# EAGLE design smarties_sorter (EAGLE 6.1)
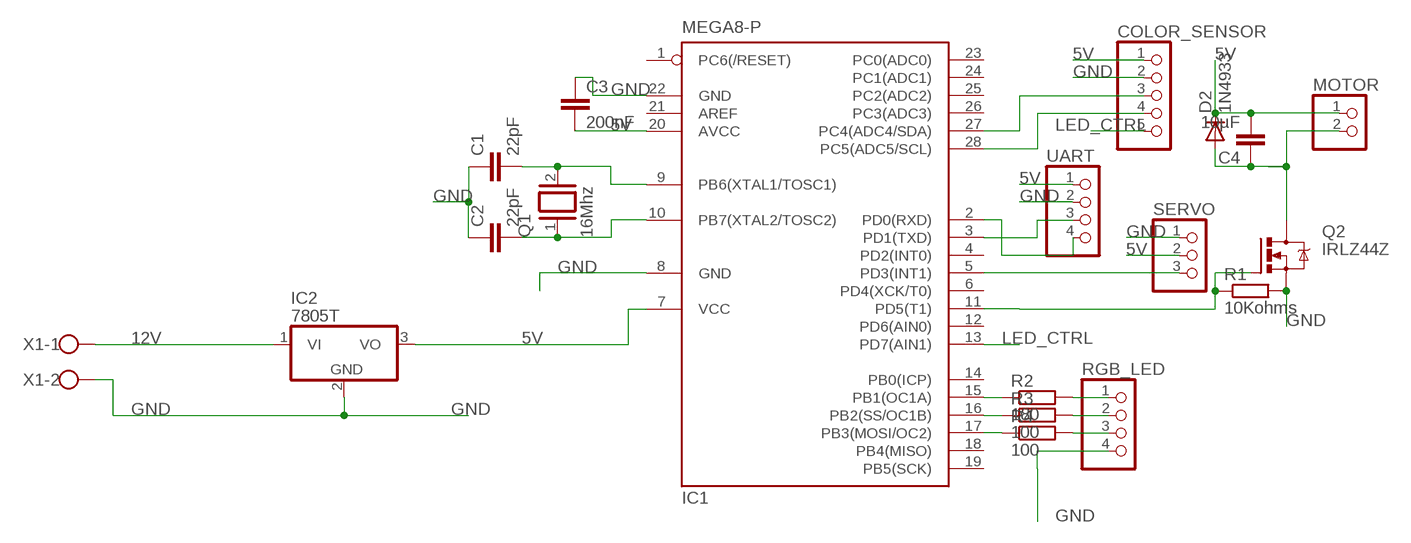
[diagram p0: schematic, sheet 1]

## Parts
C1  22pF  C5/5  [C5B5]
C2  22pF  C5/5  [C5B5]
C3  200nF  C5/3  [C5B3]
C4  10µF  C5/5  [C5B5]
COLOR_SENSOR  PINHD-1X5  [1X05]
D2  1N4933  [DO41-10]
IC1  MEGA8-P  [DIL28-3]
IC2  7805T  [TO220H]
MOTOR  PINHD-1X2  [1X02]
Q1  16Mhz  XTAL/S  [QS]
Q2  IRLZ44Z  [TO220BH]
R1  10Kohms  R-EU_0414/15  [0414/15]
R2  180  R-EU_0411/12  [0411/12]
R3  100  R-EU_0411/12  [0411/12]
R4  100  R-EU_0411/12  [0411/12]
RGB_LED  PINHD-1X4  [1X04]
SERVO  PINHD-1X3  [1X03]
UART  PINHD-1X4  [1X04]
X1  W237-102  [W237-102]

## Nets
5V: C3.2 C4.2 COLOR_SENSOR.1 D2.C IC1.7(VCC) IC1.20(AVCC) IC2.3(VO) MOTOR.1 SERVO.2 UART.1
12V: IC2.1(VI) X1.1
B_LED: IC1.17(PB3(MOSI/OC2)) R4.1
DRAIN: C4.1 D2.A MOTOR.2 Q2.D
G_LED: IC1.16(PB2(SS/OC1B)) R3.1
GND: C1.1 C2.1 C3.1 COLOR_SENSOR.2 IC1.8(GND) IC1.22(GND) IC2.2(GND) Q2.S R1.2 RGB_LED.4 SERVO.1 UART.2 X1.2
LED_CTRL: COLOR_SENSOR.5 IC1.13(PD7(AIN1))
MOTOR_CMD: IC1.11(PD5(T1)) Q2.G R1.1
N$1: C1.2 IC1.9(PB6(XTAL1/TOSC1)) Q1.2
N$2: C2.2 IC1.10(PB7(XTAL2/TOSC2)) Q1.1
N$5: R2.2 RGB_LED.1
N$10: R3.2 RGB_LED.2
N$12: R4.2 RGB_LED.3
R_LED: IC1.15(PB1(OC1A)) R2.1
RX: IC1.2(PD0(RXD)) UART.4
SCL: COLOR_SENSOR.4 IC1.28(PC5(ADC5/SCL))
SDA: COLOR_SENSOR.3 IC1.27(PC4(ADC4/SDA))
SERVO_CMD: IC1.5(PD3(INT1)) SERVO.3
TX: IC1.3(PD1(TXD)) UART.3
Unconnected: IC1.1(PC6(/RESET)) IC1.4(PD2(INT0)) IC1.6(PD4(XCK/T0)) IC1.12(PD6(AIN0)) IC1.14(PB0(ICP)) IC1.18(PB4(MISO)) IC1.19(PB5(SCK)) IC1.21(AREF) IC1.23(PC0(ADC0)) IC1.24(PC1(ADC1)) IC1.25(PC2(ADC2)) IC1.26(PC3(ADC3))

## Library data of the parts
C1-C4 = capacitor-wima:C: CAPACITOR naming: grid - package width
COLOR_SENSOR = pinhead:PINHD-1X5: PIN HEADER
D2 = diode:1N4933: DIODE fast recovery rectifier, 1A
IC1 = atmel:MEGA8-P: MICROCONTROLLER 8 Kbytes FLASH, 1 kbytes SRAM, 512 bytes EEPROM, USART, 4-channel 10 bit ADC, 2-channel 8 bit ADC Pin compatible with Atmega48, ATMega88, ATMega168 Source: avr.lbr; OC_FARNELL: unknown; OC_NEWARK: unknown
IC2 = linear:78*: Positive VOLTAGE REGULATOR Source: http://cache.national.com/ds/LM/LM78L05.pdf http://www.fairchildsemi.com/ds/LM/LM7805.pdf
MOTOR = pinhead:PINHD-1X2: PIN HEADER
Q1 = special:XTAL/S: CRYSTAL
Q2 = transistor-power:IRLZ44Z: N-Channel HEXFET® Power MOSFET Logic Level AUTOMOTIVE MOSFET Source: http://www.irf.com/product-info/datasheets/data/irlz44zpbf.pdf
R1 = rcl:R-EU_: RESISTOR, European symbol
R2-R4 = resistor:R-EU_: RESISTOR, European symbol
RGB_LED UART = pinhead:PINHD-1X4: PIN HEADER
SERVO = pinhead:PINHD-1X3: PIN HEADER
X1 = con-wago-500:W237-102: WAGO SCREW CLAMP; MPN: 237-102; OC_FARNELL: unknown; OC_NEWARK: 70K9898

## Board
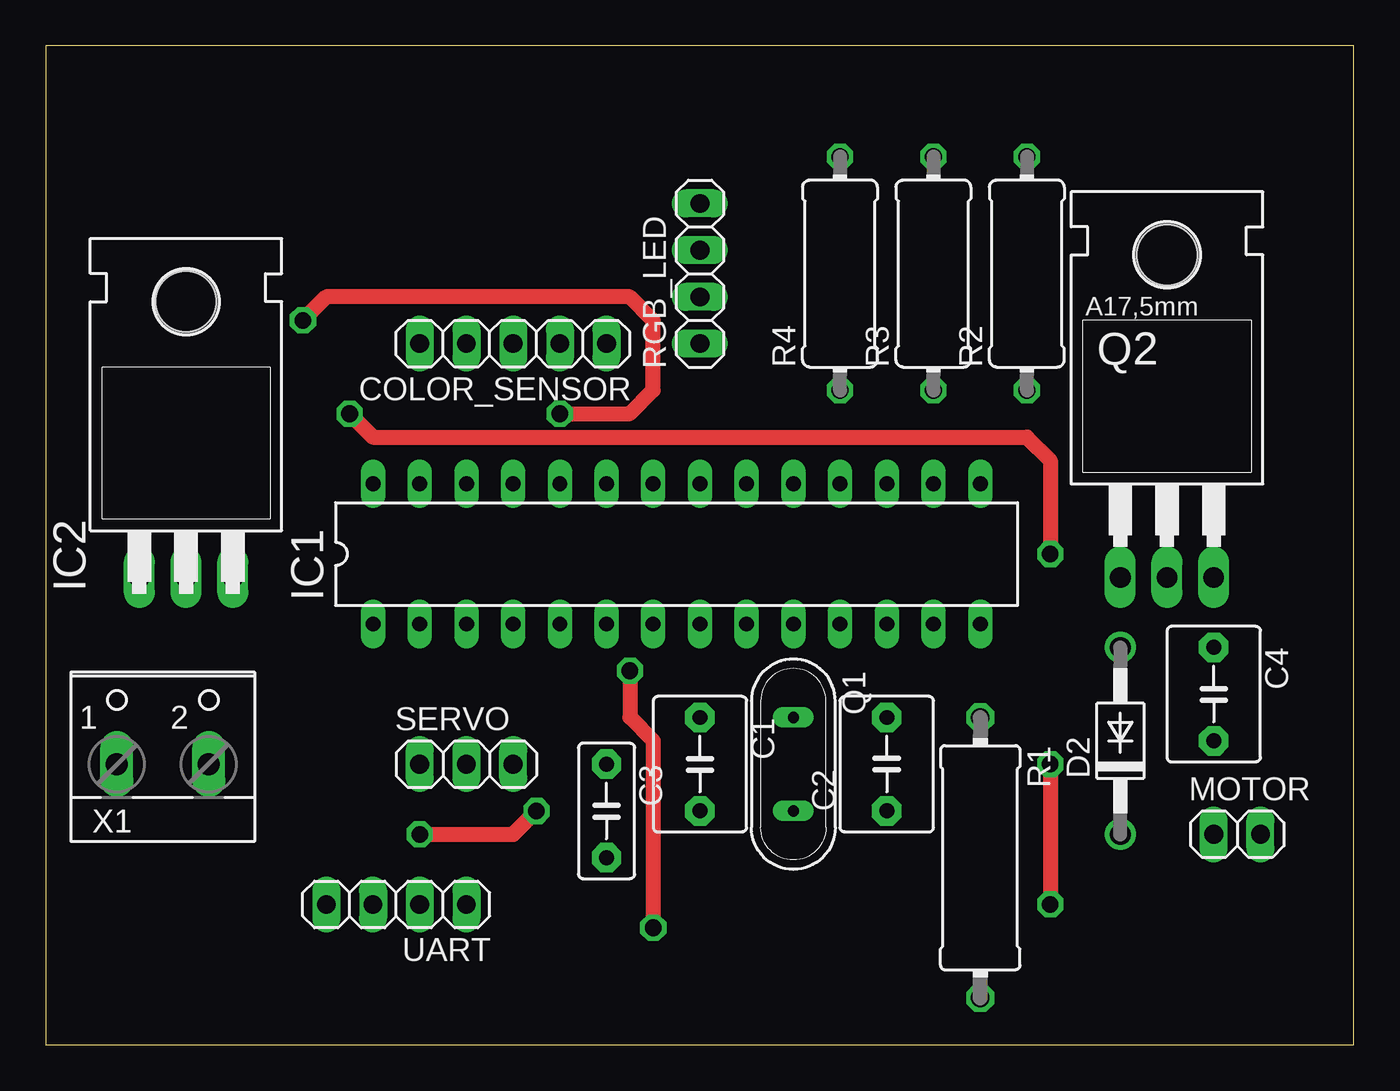
[diagram p1: board, top side]
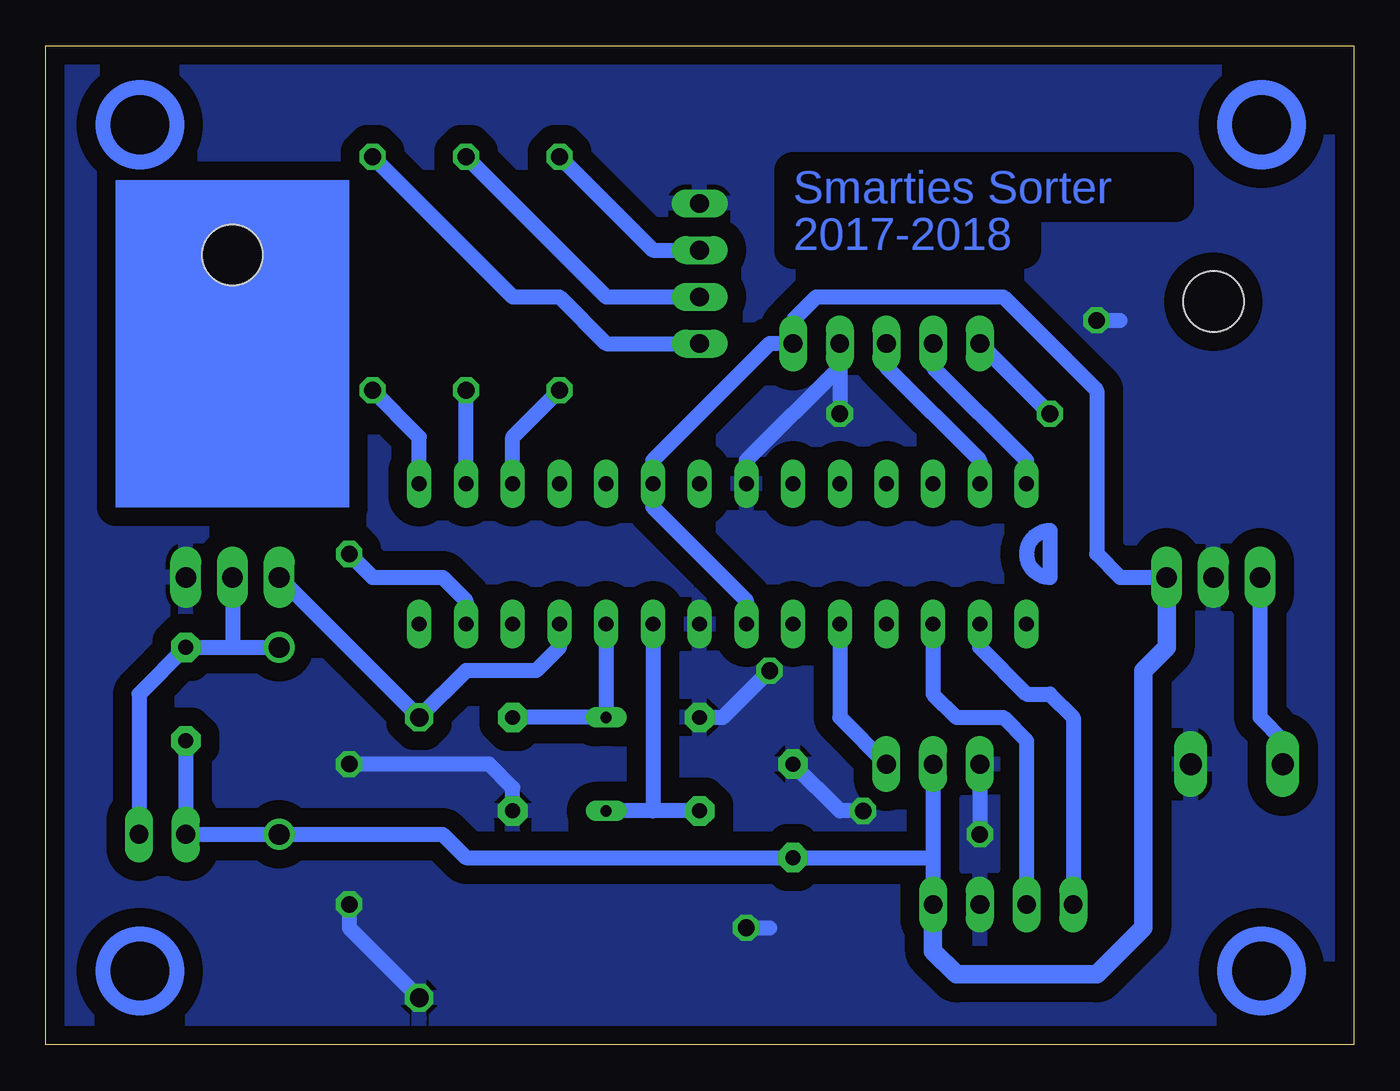
[diagram p2: board, bottom side, seen from below]

Size 71.1 x 54.28 mm. Coordinates in mm from the lower left corner, seen from the top.
Outline: 0,0 71.1,0 71.1,54.28 0,54.28 0,0
Copper layers (1*16): Top 0.035mm / dielectric 1.5mm / Bottom 0.035mm
Design rules: minimum track width 10mil, minimum drill 24mil, track to track 40mil, track to pad 30mil, pad to pad 16mil, via to via 16mil, smd to smd 8mil, copper to edge 40mil, drill to drill 8mil, minimum pad ring 10mil, minimum via ring 8mil, stop-mask expansion 4mil, vias tented up to drill 0mil, thermal gap 10mil

### Footprints (pad centres in the part's own frame; a part is rotated, then mirrored left to right if it is on the bottom)
C5B5 = drill 0.813 pad 1.6 octagon: 1 -2.54,0; 2 2.54,0
C5B3 = drill 0.813 pad 1.6 octagon: 1 -2.54,0; 2 2.54,0
1X05 = drill 1.016 long: 1 -5.08,0; 2 -2.54,0; 3 0,0; 4 2.54,0; 5 5.08,0
DO41-10 = drill 1.118: A 5.08,0; C -5.08,0
DIL28-3 = drill 0.813 long: 1 -16.51,-3.81; 2 -13.97,-3.81; 3 -11.43,-3.81; 4 -8.89,-3.81; 5 -6.35,-3.81; 6 -3.81,-3.81; 7 -1.27,-3.81; 8 1.27,-3.81; 9 3.81,-3.81; 10 6.35,-3.81; 11 8.89,-3.81; 12 11.43,-3.81; 13 13.97,-3.81; 14 16.51,-3.81; 15 16.51,3.81; 16 13.97,3.81; 17 11.43,3.81; 18 8.89,3.81; 19 6.35,3.81; 20 3.81,3.81; 21 1.27,3.81; 22 -1.27,3.81; 23 -3.81,3.81; 24 -6.35,3.81; 25 -8.89,3.81; 26 -11.43,3.81; 27 -13.97,3.81; 28 -16.51,3.81
TO220H = drill 1.118 long: 1 -2.54,-10.16; 2 0,-10.16; 3 2.54,-10.16 | hole 3.302: 0,4.826
1X02 = drill 1.016 long: 1 -1.27,0; 2 1.27,0
QS = drill 0.61 long: 1 -2.54,0; 2 2.54,0
TO220BH = drill 1.118 long: D 0,-6.35; G -2.54,-6.35; S 2.54,-6.35 | hole 3.302: 0,11.176
0414/15 = drill 1.016 octagon: 1 -7.62,0; 2 7.62,0
0411/12 = drill 0.914 octagon: 1 -6.35,0; 2 6.35,0
1X04 = drill 1.016 long: 1 -3.81,0; 2 -1.27,0; 3 1.27,0; 4 3.81,0
1X03 = drill 1.016 long: 1 -2.54,0; 2 0,0; 3 2.54,0
W237-102 = drill 1.194 long: 1 -2.5,-1.27; 2 2.5,-1.27

### Placement (x,y rotation side)
C1  35.56,15.24 270 top
C2  45.72,15.24 90 top
C3  30.48,12.7 270 top
C4  63.5,19.05 270 top
COLOR_SENSOR  25.4,38.1 180 top
D2  58.42,16.51 90 top
IC1  34.29,26.67 0 top
IC2  7.62,35.56 0 top
MOTOR  64.77,11.43 0 top
Q1  40.64,15.24 270 top
Q2  60.96,31.75 0 top
R1  50.8,10.16 270 top
R2  53.34,41.91 90 top
R3  48.26,41.91 90 top
R4  43.18,41.91 90 top
RGB_LED  35.56,41.91 90 top
SERVO  22.86,15.24 0 top
UART  19.05,7.62 180 top
X1  6.35,16.51 0 top

### Tracks (layer width: path | path; a pad name or v marks a point on that pad's centre or on a via)
5V
  Bottom 0.813: SERVO.2 22.86,10.16 | 22.86,10.16 UART.1 | 22.86,10.16 C3.2 48.26,10.16 49.53,11.43 D2.C MOTOR.1 C4.2 | IC1.7 33.02,24.13 38.1,29.21 IC1.20 38.1,31.75 31.75,38.1 COLOR_SENSOR.1 30.48,39.37 29.21,40.64 19.05,40.64 13.97,35.56 13.97,26.67 12.7,25.4 IC2.3
  Bottom 1.016: IC2.3 10.16,21.59 11.43,20.32 11.43,6.35 13.97,3.81 21.59,3.81 22.86,5.08 UART.1
12V
  Bottom 0.813: X1.1 3.81,16.51 5.08,17.78 5.08,25.36 5.12,25.36 IC2.1
B_LED
  Bottom 0.813: IC1.17 45.72,33.02 R4.1
DRAIN
  Bottom 0.813: Q2.D 60.96,21.59 | 60.96,21.59 D2.A | 60.96,21.59 C4.1 66.04,19.05 MOTOR.2
G_LED
  Bottom 0.813: IC1.16 R3.1
GND  (via drill 0.9 pad 1.42)
  Top 0.813: v54.61,15.24 v54.61,7.62 | v20.32,11.43 25.4,11.43 v26.67,12.7 | v31.75,20.32 31.75,17.78 33.02,16.51 v33.02,6.35 | v27.94,34.29 31.75,34.29 33.02,35.56 33.02,39.37 31.75,40.64 15.24,40.64 v13.97,39.37
  Bottom 0.813: IC1.22 33.02,31.75 27.94,36.83 COLOR_SENSOR.2 v27.94,34.29 | C2.1 45.72,13.97 46.99,15.24 v54.61,15.24 | v54.61,7.62 54.61,6.35 R1.2 | SERVO.1 v20.32,11.43 | v26.67,12.7 27.94,12.7 C3.1 | C1.1 34.29,17.78 v31.75,20.32 | v33.02,6.35 31.75,6.35 | v13.97,39.37 12.7,39.37
  pour Bottom: 0,54.61 71.12,54.61 71.12,0 0,0
LED_CTRL  (via drill 0.9 pad 1.42)
  Top 0.813: v16.51,34.29 17.78,33.02 53.34,33.02 54.61,31.75 v54.61,26.67
  Bottom 0.813: COLOR_SENSOR.5 v16.51,34.29 | v54.61,26.67 53.34,25.4 49.53,25.4 48.26,24.13 IC1.13
MOTOR_CMD
  Bottom 0.813: IC1.11 43.18,21.59 44.45,20.32 48.26,20.32 R1.1 Q2.G
N$1
  Bottom 0.813: C1.2 38.1,12.7 | 38.1,12.7 Q1.2 | IC1.9 38.1,12.7
N$2
  Bottom 0.813: IC1.10 Q1.1 C2.2
N$3
  Bottom 0.813: 16.51,27.94 16.51,25.4 arc180 16.51,27.94
N$5
  Bottom 0.813: R2.2 45.72,40.64 43.18,40.64 40.64,38.1 RGB_LED.1
N$10
  Bottom 0.813: R3.2 40.64,40.64 RGB_LED.2
N$12
  Bottom 0.813: R4.2 38.1,43.18 RGB_LED.3
R_LED
  Bottom 0.813: IC1.15 50.8,33.02 R2.1
RX
  Bottom 0.813: IC1.2 20.32,21.59 17.78,19.05 16.51,19.05 15.24,17.78 UART.4
SCL
  Bottom 0.813: COLOR_SENSOR.4 22.86,36.83 17.78,31.75 IC1.28
SDA
  Bottom 0.813: COLOR_SENSOR.3 25.4,36.83 20.32,31.75 IC1.27
SERVO_CMD
  Bottom 0.813: IC1.5 27.94,17.78 SERVO.3
TX
  Bottom 0.813: IC1.3 22.86,19.05 21.59,17.78 19.05,17.78 17.78,16.51 UART.3
(copper drawn outside any net)
  shapes: Bottom area x1, Bottom circle x4

### Text on the board
Bottom: Smarties Sorter | 2017-2018